# EAGLE schematic gate (EAGLE 7.6.0)
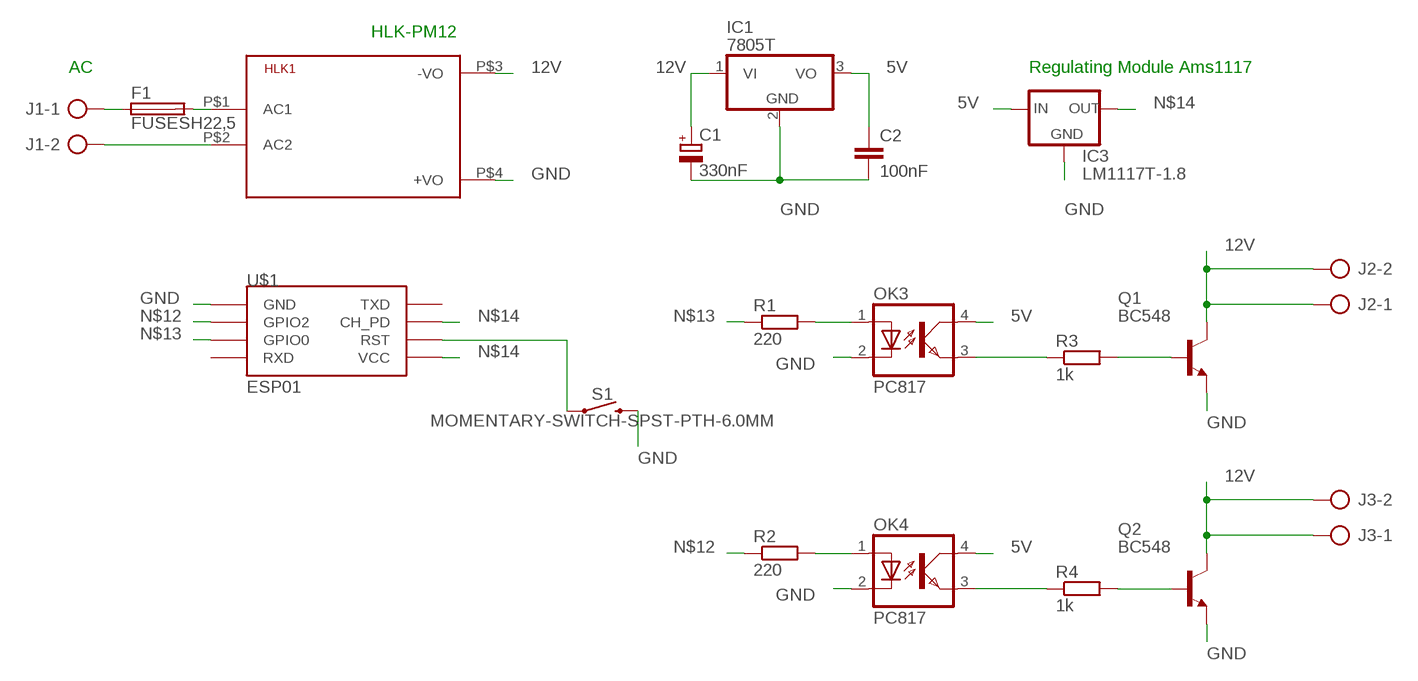
[diagram p0: schematic, sheet 1]

## Parts
C1  330nF  CPOL-EUE2.5-6  [E2,5-6]
C2  100nF  C-EU050-024X044  [C050-024X044]
F1  FUSESH22,5  [SH22,5]
HLK1  HLK-PM013W  [HLK-PM01]
IC1  7805T  [TO220H]
IC3  LM1117T-1.8  [TO220]
J1  AK500/2-H  [AK500/2-H]
J2  AK500/2-H  [AK500/2-H]
J3  AK500/2-H  [AK500/2-H]
OK3  PC817  [DIL04]
OK4  PC817  [DIL04]
Q1  BC548  [TO92-EBC]
Q2  BC548  [TO92-EBC]
R1  220  R-EU_0204/7  [0204/7]
R2  220  R-EU_0204/7  [0204/7]
R3  1k  R-EU_0204/7  [0204/7]
R4  1k  R-EU_0204/7  [0204/7]
S1  MOMENTARY-SWITCH-SPST-PTH-6.0MM  [TACTILE_SWITCH_PTH_6.0MM]
U$1  ESP01  [ESP01]

## Nets
5V: C2.1 IC1.3(VO) IC3.3(IN) OK3.4(COL) OK4.4(COL)
12V: C1.+ HLK1.P$3(-VO) IC1.1(VI) J2.1 J2.2 J3.1 J3.2 Q1.C Q2.C
GND: C1.- C2.2 HLK1.P$4(+VO) IC1.2(GND) IC3.1(GND) OK3.2(C) OK4.2(C) Q1.E Q2.E S1.3 U$1.GND
N$1: F1.1 J1.1
N$2: F1.2 HLK1.P$1(AC1)
N$3: HLK1.P$2(AC2) J1.2
N$4: OK3.1(A) R1.2
N$5: OK4.1(A) R2.2
N$6: Q1.B R3.2
N$7: Q2.B R4.2
N$8: OK4.3(EMIT) R4.1
N$9: OK3.3(EMIT) R3.1
N$10: S1.1 U$1.RST
N$12: R2.1 U$1.GPIO2
N$13: R1.1 U$1.GPIO0
N$14: IC3.2(OUT) U$1.CH_PD U$1.VCC
Unconnected: U$1.RX(RXD) U$1.TX(TXD)

## Notes on the sheet
- HLK-PM12
- AC | Regulating Module Ams1117

## Library data of the parts
C1 = rcl:CPOL-EU: POLARIZED CAPACITOR, European symbol
C2 = rcl:C-EU: CAPACITOR, European symbol
F1 = fuse:FUSE: Fuse; OC_FARNELL: unknown; OC_NEWARK: unknown
HLK1 = HLK-PM01:HLK-PM01: Hi-Link Power Supply HLK-PM01 3W Author: Ahmed Said <https://github.com/AhmedSaid/EAGLELibraries>
IC1 = linear:78*: Positive VOLTAGE REGULATOR Source: http://cache.national.com/ds/LM/LM78L05.pdf http://www.fairchildsemi.com/ds/LM/LM7805.pdf
IC3 = lm1117:LM1117T-*
J1-J3 = con-ptr500:AK500/2-H: CONNECTOR Aug. 2004 / PTR Meßtechnik: Die Bezeichnung der Serie AK505 wurde geändert. Es handelt sich hierbei um AK500 in horizontaler Ausführung.; OC_FARNELL: unknown; OC_NEWARK: unknown
OK3 OK4 = optocoupler:PC817: SHARP OPTO COUPLER; MPN: PC817X4J000F; OC_FARNELL: 9707727; OC_NEWARK: 97K7059
Q1 Q2 = transistor-npn:BC548*: NPN Transistor
R1-R4 = resistor:R-EU_: RESISTOR, European symbol
S1 = SparkFun-Switches:MOMENTARY-SWITCH-SPST: Momentary Switch (Pushbutton) - SPST Normally-open (NO) SPST momentary switches (buttons, pushbuttons). Variants PTH-12MM - 12mm square, through-hole Momentary Pushbutton Switch - 12mm Square <https://www.sparkfun.com/products/9190> (COM-09190) PTH-6.0MM, PTH-6.0MM-KIT - 6.0mm square, through-hole Mini Pushbutton Switch <https://www.sparkfun.com/products/97> (COM-00097) KIT package intended for soldering kit's - only one side of pads' copper is exposed. PTH-RIGHT-ANGLE-KIT - Right-angle, through-hole Right Angle Tactile Button <https://www.sparkfun.com/products/10791> - Used on SparkFun BigTime Watch Kit <https://www.sparkfun.com/products/11734> SMD-12MM - 12mm square, surface-mount Tactile Button - SMD (12mm) <https://www.sparkfun.com/products/12993> (COM-12993) Used on SparkFun PicoBoard <https://www.sparkfun.com/products/11888> SMD-4.5MM - 4.5mm Square Trackball Switch Used on SparkFun Blackberry Trackballer Breakout <https://www.sparkfun.com/products/13169> SMD-4.6MMX2.8MM - 4.60mm x 2.80mm, surface mount Used on SparkFun SAMD21 Mini Breakout <https://www.sparkfun.com/products/13664> SMD-5.2MM, SMD-5.2-REDUNDANT - 5.2mm square, surface-mount Mini Pushbutton Switch - SMD <https://www.sparkfun.com/products/8720> (COM-08720) Used on Arduino Pro Mini <https://www.sparkfun.com/products/11114> REDUNDANT package connects both switch circuits together SMD-6.0X3.5MM - 6.0 x 3.5mm, surface mount Momentary Reset Switch SMD <https://www.sparkfun.com/products/8229> (COM-08229) SMD-6.2MM-TALL - 6.2mm square, surface mount Tactile Button - SMD (6mm) <https://www.sparkfun.com/products/12992> Used on SparkFun Digital Sandbox <https://www.sparkfun.com/products/12651> SMD-RIGHT-ANGLE - Right-angle, surface mount Used on SparkFun Block for Intel® Edison - Arduino <https://www.sparkfun.com/products/13036>; PROD_ID: SWCH-08441; SF_SKU: COM-00097
U$1 = esp8266modules:ESP01: ESP8266 Wifi module 01